# Altium schematic sheet ecg_emg_res.SchDoc
size A2; SheetNumber: 1; SheetTotal: 1
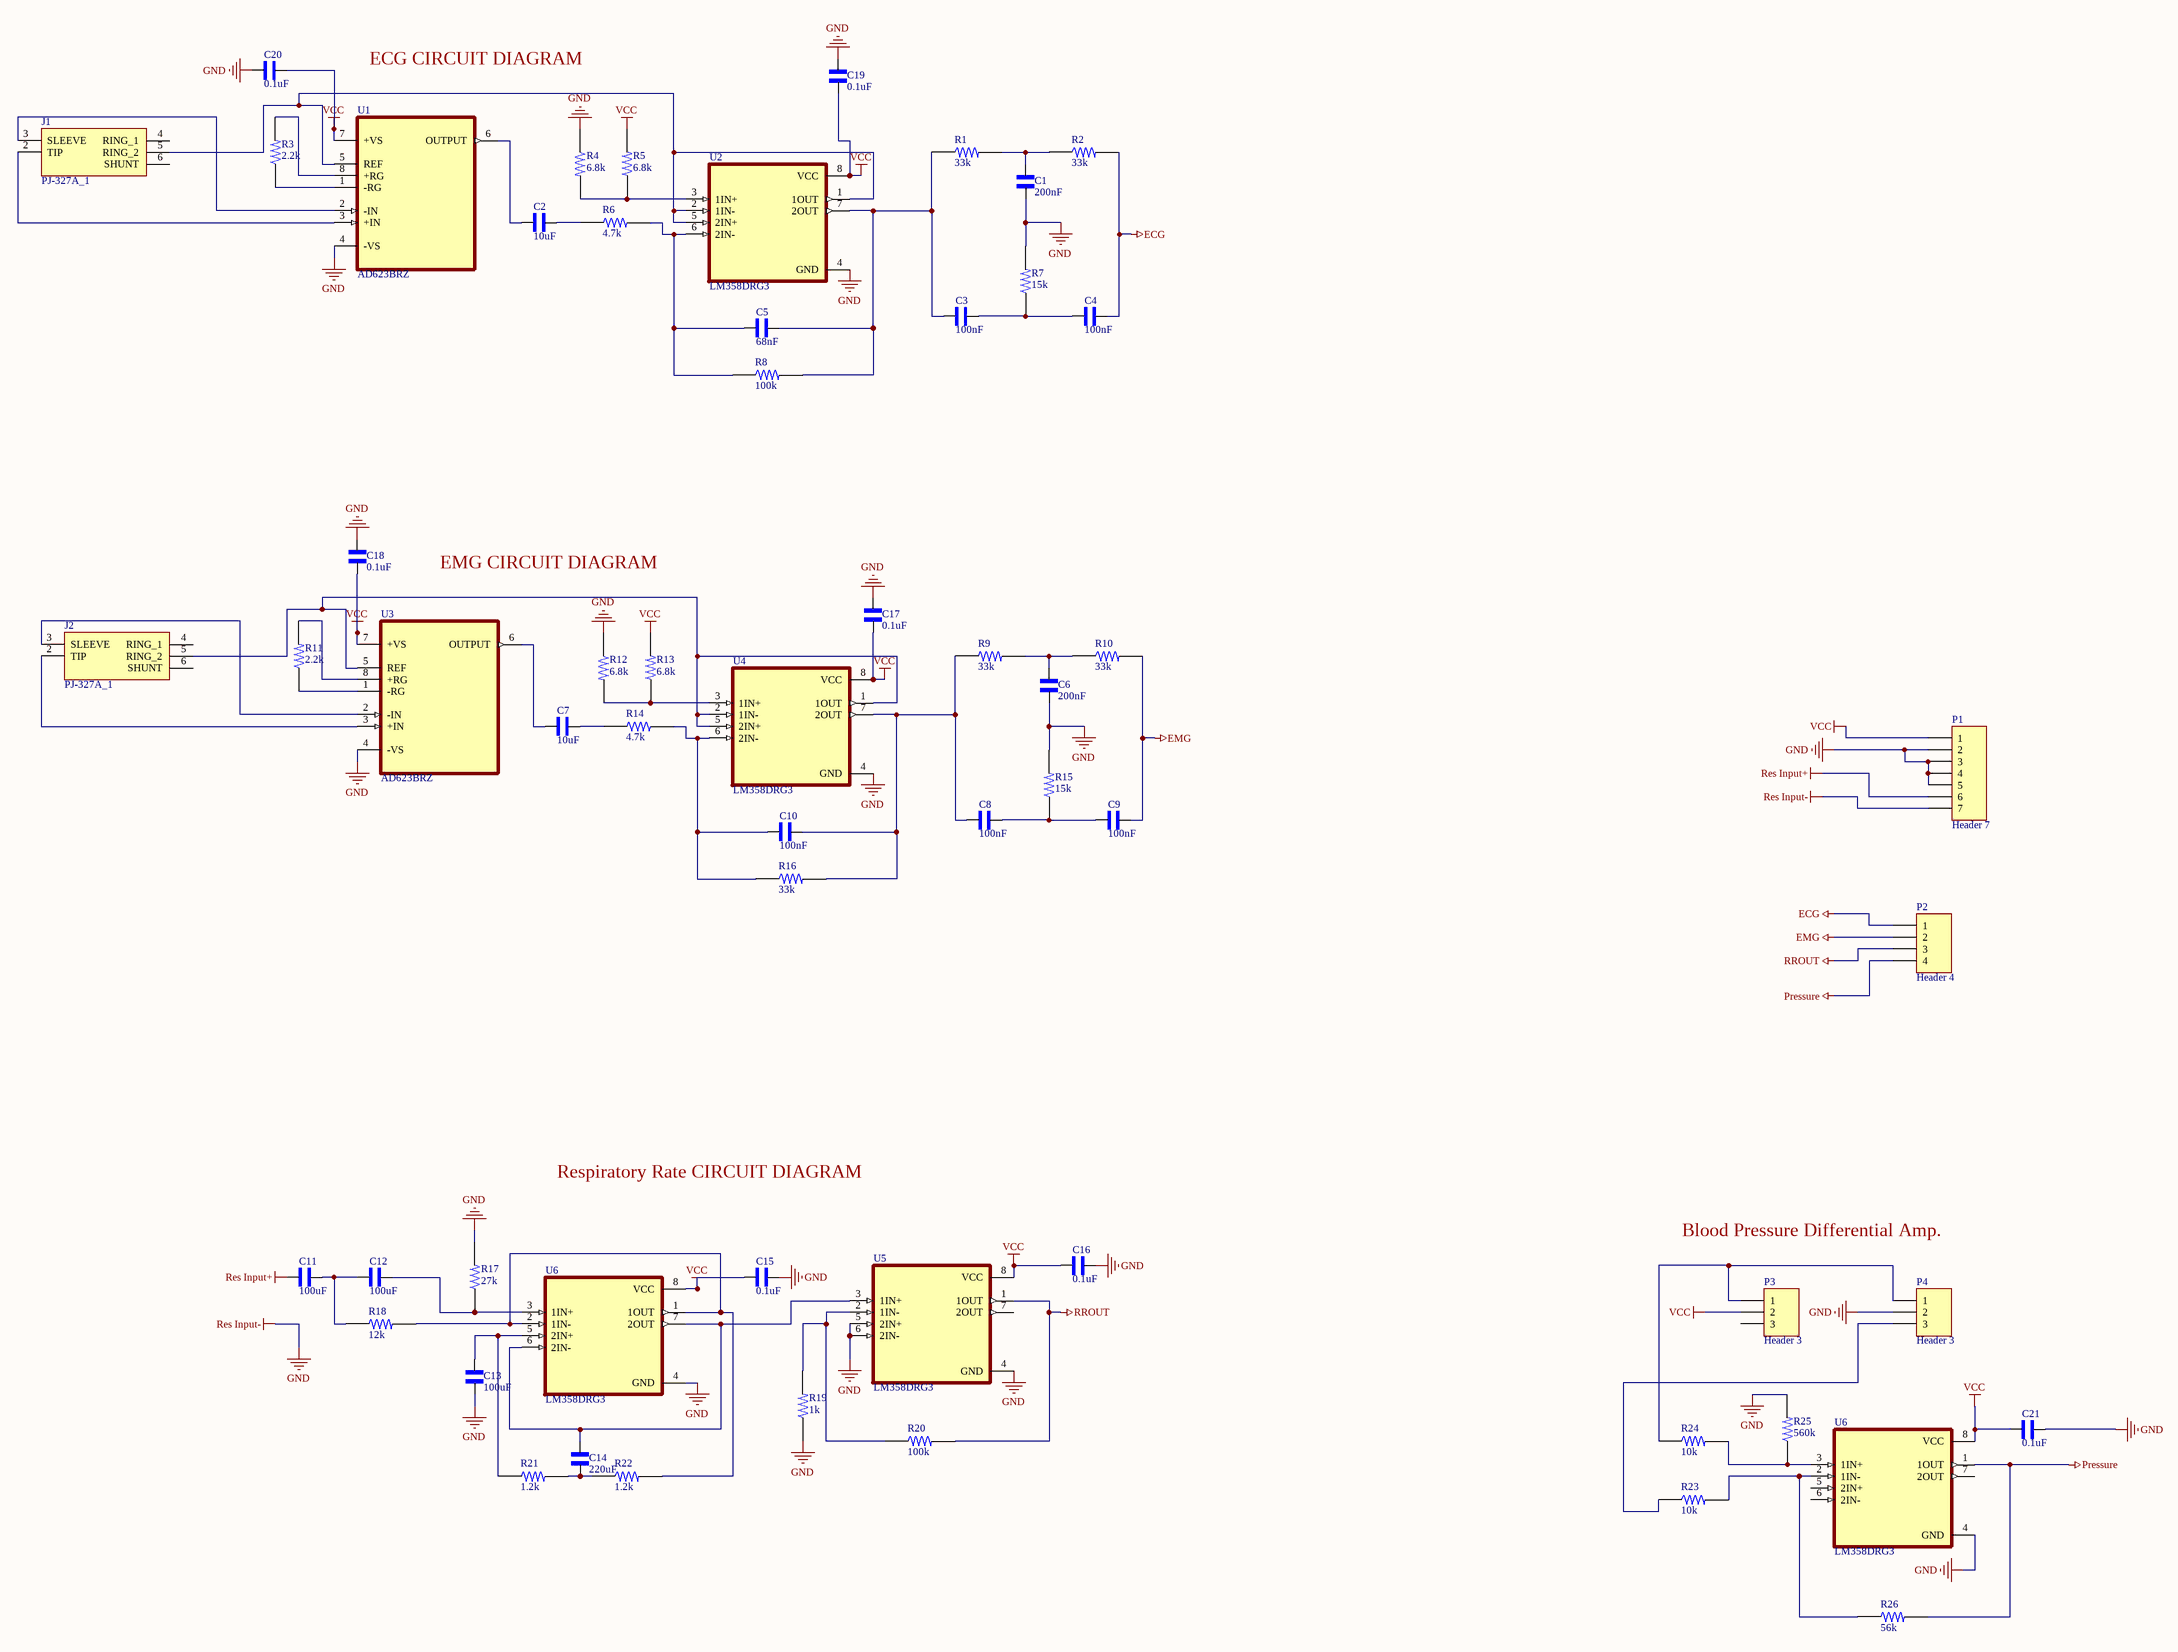
[diagram p0: ecg_emg_res.SchDoc]

## Parts
(Parts that share a designator on the sheet are numbered #1, #2 ... from top to bottom, then left to right.)
C1  200nF  [C0805]
C2  10uF  [C0805]
C3  100nF  [C0805]
C4  100nF  [C0805]
C5  68nF  [C0805]
C6  200nF  [C0805]
C7  10uF  [C0805]
C8  100nF  [C0805]
C9  100nF  [C0805]
C10  100nF  [C0805]
C11  100uF  [C0805]
C12  100uF  [C0805]
C13  100uF  [C0805]
C14  220uF  [C0805]
C15  0.1uF  [C0805]
C16  0.1uF  [C0805]
C17  0.1uF  [C0805]
C18  0.1uF  [C0805]
C19  0.1uF  [C0805]
C20  0.1uF  [C0805]
C21  0.1uF  [C0805]
J1  PJ-327A_1  [PJ327A]
J2  PJ-327A_1  [PJ327A]
P1  Header 7  [HDR1X7]
P2  Header 4  [HDR1X4]
P3  Header 3  [HDR1X3]
P4  Header 3  [HDR1X3]
R1  33k  [R0805]
R2  33k  [R0805]
R3  2.2k  [R0805]
R4  6.8k  [R0805]
R5  6.8k  [R0805]
R6  4.7k  [R0805]
R7  15k  [R0805]
R8  100k  [R0805]
R9  33k  [R0805]
R10  33k  [R0805]
R11  2.2k  [R0805]
R12  6.8k  [R0805]
R13  6.8k  [R0805]
R14  4.7k  [R0805]
R15  15k  [R0805]
R16  33k  [R0805]
R17  27k  [R0805]
R18  12k  [R0805]
R19  1k  [R0805]
R20  100k  [R0805]
R21  1.2k  [R0805]
R22  1.2k  [R0805]
R23  10k  [R0805]
R24  10k  [R0805]
R25  560k  [R0805]
R26  56k  [R0805]
U1  AD623BRZ  [SOIC127P599X175-8N]
U2  LM358DRG3  [SOIC-8]
U3  AD623BRZ  [SOIC127P599X175-8N]
U4  LM358DRG3  [SOIC-8]
U5  LM358DRG3  [SOIC-8]
U6#1  LM358DRG3  [SOIC-8]
U6#2  LM358DRG3  [SOIC-8]

## Nets
ECG: C4.1 P2.1 R2.2
EMG: C9.1 P2.2 R10.2
GND: C1.2 C6.2 C13.2 C15.1 C16.1 C17.1 C18.1 C19.1 C20.1 C21.1 P1.2 P1.3 P1.4 P1.5 P1.7 P4.2 R4.1 R7.2 R12.1 R15.2 R17.2 R19.1 R25.2 U1.4(-VS) U2.4(GND) U3.4(-VS) U4.4(GND) U5.4(GND) U5.5(2IN+) U5.6(2IN-) U6#1.4(GND) U6#2.4(GND)  [also labelled Res Input-]
Pressure: P2.4 R26.2 U6#2.1(1OUT)
Res Input+: C11.2 P1.6
RROUT: P2.3 R20.2 U5.1(1OUT)
VCC: C15.2 C16.2 C17.2 C18.2 C19.2 C20.2 C21.2 P1.1 P3.2 R5.2 R13.2 U1.7(+VS) U2.8(VCC) U3.7(+VS) U4.8(VCC) U5.8(VCC) U6#1.8(VCC) U6#2.8(VCC)
NetC1_1: C1.1 R1.2 R2.1
NetC2_1: C2.1 R6.1
NetC2_2: C2.2 U1.6(OUTPUT)
NetC3_1: C3.1 C4.2 R7.1
NetC3_2: C3.2 C5.1 R1.1 R8.2 U2.7(2OUT)
NetC5_2: C5.2 R6.2 R8.1 U2.6(2IN-)
NetC6_1: C6.1 R9.2 R10.1
NetC7_1: C7.1 R14.1
NetC7_2: C7.2 U3.6(OUTPUT)
NetC8_1: C8.1 C9.2 R15.1
NetC8_2: C8.2 C10.1 R9.1 R16.2 U4.7(2OUT)
NetC10_2: C10.2 R14.2 R16.1 U4.6(2IN-)
NetC11_1: C11.1 C12.2 R18.1
NetC12_1: C12.1 R17.1 U6#1.3(1IN+)
NetC13_1: C13.1 R21.1 U6#1.5(2IN+)
NetC14_1: C14.1 U5.3(1IN+) U6#1.6(2IN-) U6#1.7(2OUT)
NetC14_2: C14.2 R21.2 R22.1
NetJ1_2: J1.2(TIP) U1.3(+IN)
NetJ1_3: J1.3(SLEEVE) U1.2(-IN)
NetJ1_5: J1.5(RING_2) U1.5(REF) U2.1(1OUT) U2.2(1IN-) U2.5(2IN+)
NetJ2_2: J2.2(TIP) U3.3(+IN)
NetJ2_3: J2.3(SLEEVE) U3.2(-IN)
NetJ2_5: J2.5(RING_2) U3.5(REF) U4.1(1OUT) U4.2(1IN-) U4.5(2IN+)
NetP3_1: P3.1 P4.1 R24.1
NetP4_3: P4.3 R23.1
NetR3_1: R3.1 U1.1(-RG)
NetR3_2: R3.2 U1.8(+RG)
NetR4_2: R4.2 R5.1 U2.3(1IN+)
NetR11_1: R11.1 U3.1(-RG)
NetR11_2: R11.2 U3.8(+RG)
NetR12_2: R12.2 R13.1 U4.3(1IN+)
NetR18_2: R18.2 R22.2 U6#1.1(1OUT) U6#1.2(1IN-)
NetR19_2: R19.2 R20.1 U5.2(1IN-)
NetR23_2: R23.2 R26.1 U6#2.2(1IN-)
NetR24_2: R24.2 R25.1 U6#2.3(1IN+)

Not connected (* = marked no-connect by the designer): J1 4(RING_1) 6(SHUNT); J2 4(RING_1) 6(SHUNT); P3 3; U5 7(2OUT); U6#2 5(2IN+) 6(2IN-) 7(2OUT)

## Notes on the sheet
- ECG CIRCUIT DIAGRAM
- EMG CIRCUIT DIAGRAM
- Respiratory Rate CIRCUIT DIAGRAM
- Blood Pressure Differential Amp.

## Library data of the parts
C1-C21 = C
J1 J2 = PJ-327A_1: Manufacturer_Name: XKB; Datasheet Link: https://datasheet.lcsc.com/szlcsc/1903151105_XKB-Enterprise-PJ-327A0-SMT_C381135.pdf; Height: 4.75mm; Manufacturer_Part_Number: PJ-327A
P1 = Header 7: Header, 7-Pin; LatestRevisionDate: 17-Jul-2002; LatestRevisionNote: Re-released for DXP Platform.; Publisher: Altium Limited
P2 = Header 4: Header, 4-Pin; LatestRevisionDate: 17-Jul-2002; LatestRevisionNote: Re-released for DXP Platform.; Publisher: Altium Limited
P3 P4 = Header 3: Header, 3-Pin; LatestRevisionDate: 17-Jul-2002; LatestRevisionNote: Re-released for DXP Platform.; Publisher: Altium Limited
R1-R26 = R
U1 U3 = AD623BRZ: Instrumentation Amplifier 1 Circuit Rail-to-Rail 8-SOIC; MF: Analog Devices; Package: SOIC-8 Analog Devices; Check_prices: https://www.snapeda.com/parts/AD623BRZ/Analog%20Devices%20Inc./view-part/9793/?ref=eda; Availability: Good; MP: AD623BRZ; Value: *; Purchase-URL: https://pricing.snapeda.com/search/part/AD623BRZ/?ref=eda; Price: None; SnapEDA_Link: https://www.snapeda.com/parts/AD623BRZ/Analog%20Devices%20Inc./view-part/9793/?ref=snap
U2 U4 U5 U6#1 U6#2 = LM358DRG3: Dual standard operational amplifier 8-SOIC 0 to 70; MF: Texas Instruments; Check_prices: https://www.snapeda.com/parts/LM358DRG3/Texas%20Instruments/view-part/793077/?ref=eda; Value: *; Price: None; Availability: Good; SnapEDA_Link: https://www.snapeda.com/parts/LM358DRG3/Texas%20Instruments/view-part/793077/?ref=snap; Package: SOIC-8 Texas Instruments; MP: LM358DRG3; Purchase-URL: https://pricing.snapeda.com/search/part/LM358DRG3/?ref=eda